# EAGLE design Adapter (EAGLE 9.6.2)
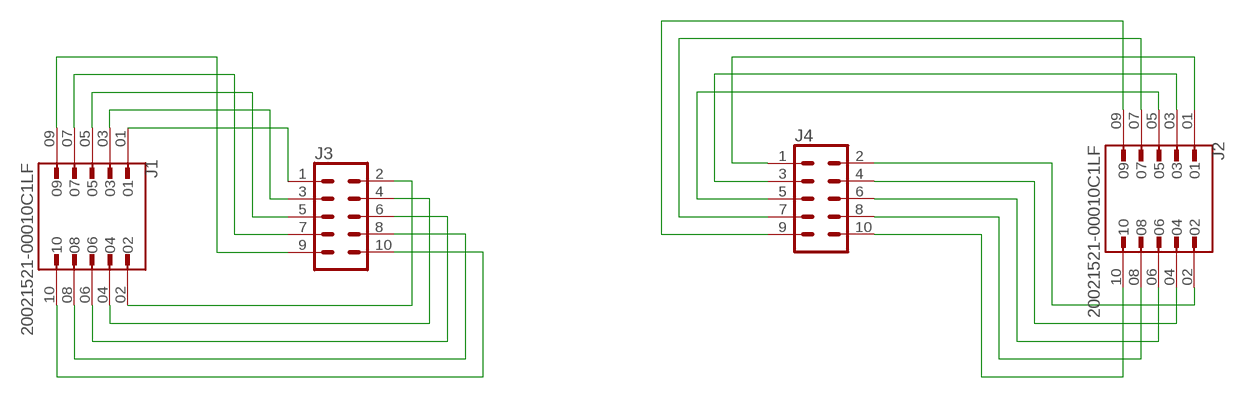
[diagram p0: schematic, sheet 1]

## Parts
J1  20021521-00010C1LF  [AMPHENOL_20021521-00010C1LF]
J2  20021521-00010C1LF  [AMPHENOL_20021521-00010C1LF]
J3  CONN_05X2NO_SILK  [2X5_NOSILK]
J4  CONN_05X2NO_SILK  [2X5_NOSILK]

## Nets
N$1: J1.01 J3.1
N$2: J1.02 J3.2
N$3: J1.03 J3.3
N$4: J1.04 J3.4
N$5: J1.05 J3.5
N$6: J1.06 J3.6
N$7: J1.07 J3.7
N$8: J1.08 J3.8
N$9: J1.09 J3.9
N$10: J1.10 J3.10
N$11: J2.01 J4.1
N$12: J2.02 J4.2
N$13: J2.03 J4.3
N$14: J2.04 J4.4
N$15: J2.05 J4.5
N$16: J2.06 J4.6
N$17: J2.07 J4.7
N$18: J2.08 J4.8
N$19: J2.09 J4.9
N$20: J2.10 J4.10

## Library data of the parts
J1 J2 = 20021521-00010C1LF:20021521-00010C1LF: Check availability <https://pricing.snapeda.com/parts/20021521-00010C1LF/AMPHENOL%20ICC%20/%20FCI/view-part?ref=eda>; AVAILABILITY: In Stock; CHECK_PRICES: https://www.snapeda.com/parts/20021521-00010C1LF/Amphenol/view-part/?ref=eda; DESCRIPTION: Minitek127®, Shrouded Board to Board Header, Surface Mount, 10 positions, 1.27mm (0.500in) pitch.; MF: AMPHENOL ICC / FCI; MP: 20021521-00010C1LF; PACKAGE: None; PRICE: None; PURCHASE-URL: https://www.snapeda.com/api/url_track_click_mouser/?unipart_id=6036216&manufacturer=AMPHENOL ICC / FCI&part_name=20021521-00010C1LF&search_term=20021521-00010c1lf; SNAPEDA_LINK: https://www.snapeda.com/parts/20021521-00010C1LF/Amphenol/view-part/?ref=snap
J3 J4 = SparkFun-Connectors:CONN_05X2: Multi connection point. Often used as Generic Header-pin footprint for 0.1 inch spaced/style header connections For AVR SPI programming port, see special device with nice symbol: "AVR_SPI_PROG_5x2.dev" You can populate with any combo of single row headers, but if you'd like an exact match, check these: 2x5 AVR ICSP Male Header <https://www.sparkfun.com/products/778> (PRT-00778) 2x5 Pin Shrouded Header <https://www.sparkfun.com/products/8506> (PRT-08506) On any of the 0.1 inch spaced packages, you can populate with these: Break Away Headers - Straight <https://www.sparkfun.com/products/116> (PRT-00116) Break Away Male Headers - Right Angle <https://www.sparkfun.com/products/553> (PRT-00553) Female Headers <https://www.sparkfun.com/products/115> (PRT-00115) Break Away Headers - Machine Pin <https://www.sparkfun.com/products/117> (PRT-00117) Break Away Female Headers - Swiss Machine Pin <https://www.sparkfun.com/products/743> (PRT-00743) Special note: the shrouded connector mates well with our 5x2 ribbon cables: 2x5 Pin IDC Ribbon Cable <https://www.sparkfun.com/products/8535> (PRT-08535)

## Net classes
0 default: width 0.305 mm

## Board
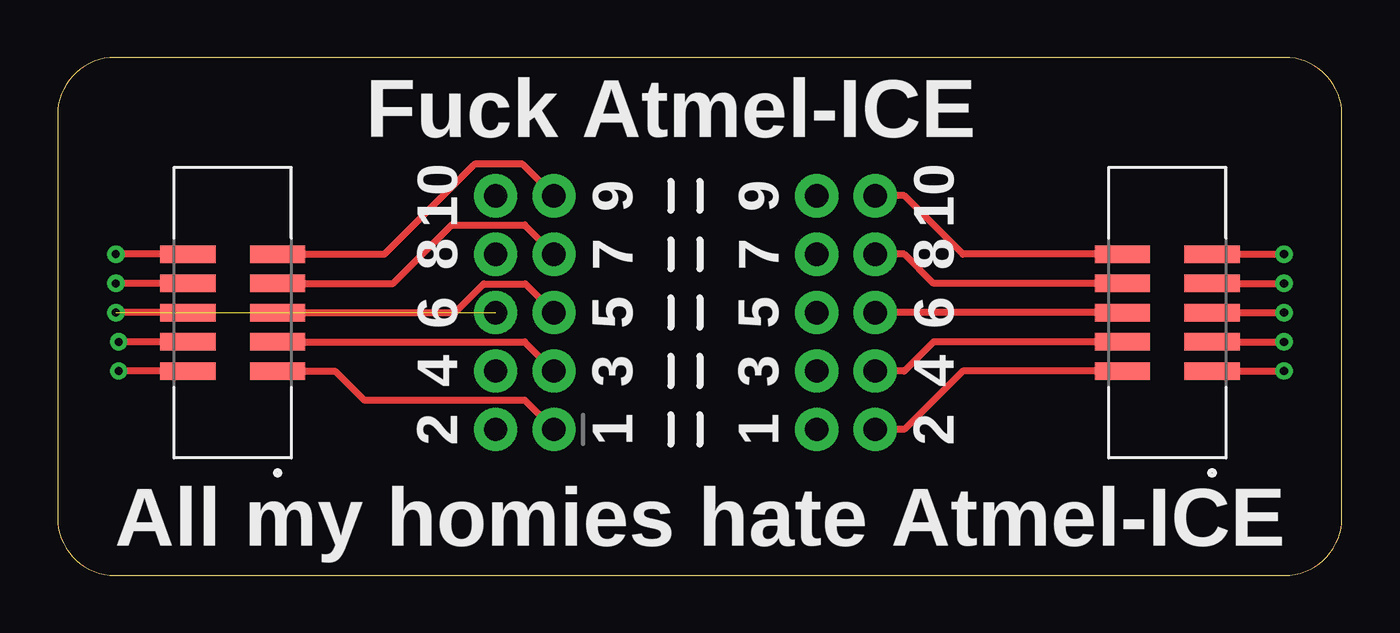
[diagram p1: board, top side]
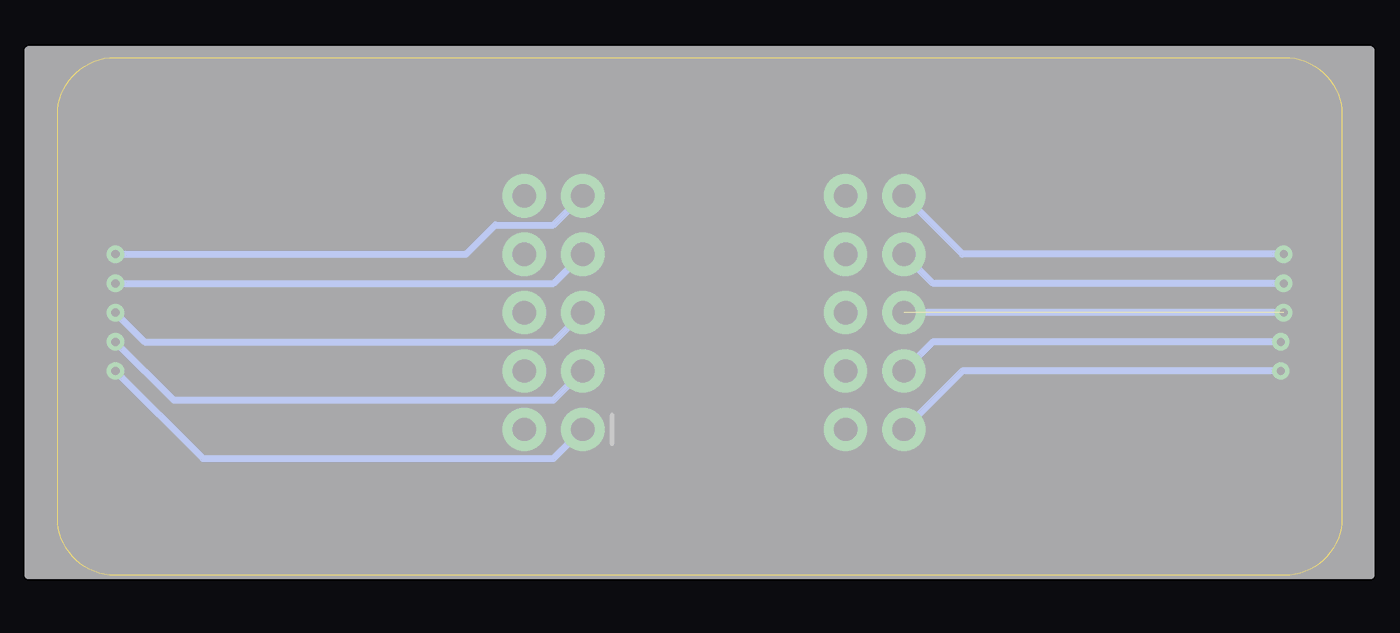
[diagram p2: board, bottom side, seen from below]

Size 55.86 x 22.53 mm. Coordinates in mm from the lower left corner, seen from the top.
Outline: 0,20.03 0,2.5 arc90 2.5,0 53.36,0 arc90 55.86,2.5 55.86,20.03 arc90 53.36,22.53 2.5,22.53 arc90 0,20.03
Copper layers (1*16): Top 0.035mm / dielectric 1.5mm / Bottom 0.035mm
Design rules "default": minimum track width 6mil, minimum drill 0.35mm, track to track 6mil, track to pad 6mil, pad to pad 6mil, via to via 6mil, smd to smd 6mil, copper to edge 40mil, drill to drill 6mil, minimum pad ring 10mil, minimum via ring 8mil, stop-mask expansion 4mil, vias tented up to drill 0mil, thermal gap 10mil

### Footprints (pad centres in the part's own frame; a part is rotated, then mirrored left to right if it is on the bottom)
AMPHENOL_20021521-00010C1LF = smd 0.76 x 2.4: 01 -2.54,-1.95; 02 -2.54,1.95; 03 -1.27,-1.95; 04 -1.27,1.95; 05 0,-1.95; 06 0,1.95; 07 1.27,-1.95; 08 1.27,1.95; 09 2.54,-1.95; 10 2.54,1.95
2X5_NOSILK = drill 1.016 pad 1.88: 1 0,0; 2 0,2.54; 3 2.54,0; 4 2.54,2.54; 5 5.08,0; 6 5.08,2.54; 7 7.62,0; 8 7.62,2.54; 9 10.16,0; 10 10.16,2.54

### Placement (x,y rotation side)
J1  7.62,11.43 90 top
J2  48.26,11.43 90 top
J3  21.59,6.35 90 top
J4  33.02,6.35 90 bottom

### Tracks (layer width: path | path; a pad name or v marks a point on that pad's centre or on a via)
N$1
  Top 0.305: J1.01 12.06,8.89 13.33,7.62 20.32,7.62 J3.1
N$2  (via drill 0.35)
  Top 0.305: J1.02 v2.66,8.89
  Bottom 0.305: v2.66,8.89 16.51,8.89 J3.2
N$3
  Top 0.305: J1.03 20.32,10.16 J3.3
N$4  (via drill 0.35)
  Top 0.305: J1.04 v2.66,10.16
  Bottom 0.305: v2.66,10.16 17.78,10.16 J3.4
N$5
  Top 0.305: J1.05 17.29,11.43 18.53,12.68 20.34,12.68 J3.5
N$6  (via drill 0.35)  (1 unrouted)
  Top 0.305: J1.06 v2.54,11.43
  Bottom 0.305: v2.54,11.43 J3.6
N$7
  Top 0.305: J1.07 14.6,12.7 17.15,15.24 20.32,15.24 J3.7
N$8  (via drill 0.35)
  Top 0.305: J1.08 v2.54,12.7
  Bottom 0.305: v2.54,12.7 17.78,12.7 J3.8
N$9
  Top 0.305: J1.09 14.22,13.97 18.16,17.91 20.19,17.91 J3.9
N$10  (via drill 0.35)
  Top 0.305: J1.10 v2.54,13.97
  Bottom 0.305: v2.54,13.97 16.51,13.97 J3.10
N$11  (via drill 0.35)
  Top 0.305: J2.01 v53.34,8.89
  Bottom 0.305: v53.34,8.89 49.53,5.08 34.29,5.08 J4.1
N$12
  Top 0.305: J2.02 39.37,8.89 36.83,6.35 J4.2
N$13  (via drill 0.35)
  Top 0.305: J2.03 v53.34,10.16
  Bottom 0.305: v53.34,10.16 50.8,7.62 34.29,7.62 J4.3
N$14
  Top 0.305: J2.04 38.1,10.16 36.83,8.89 J4.4
N$15  (via drill 0.35)
  Top 0.305: J2.05 v53.34,11.43
  Bottom 0.305: v53.34,11.43 52.07,10.16 34.29,10.16 J4.5
N$16
  Top 0.305: J2.06 J4.6
N$17  (via drill 0.35)
  Top 0.305: J2.07 v53.34,12.7
  Bottom 0.305: v53.34,12.7 34.29,12.7 J4.7
N$18
  Top 0.305: J2.08 38.1,12.7 36.83,13.97 J4.8
N$19  (via drill 0.35)
  Top 0.305: J2.09 v53.34,13.97
  Bottom 0.305: v53.34,13.97 38.1,13.97 36.83,15.24 34.29,15.24 J4.9
N$20
  Top 0.305: J2.10 39.37,13.97 36.83,16.51 J4.10

### Text on the board
tPlace: Fuck Atmel-ICE | 10 | 9 | 9 | 10 | 8 | 7 | 7 | 8 | 6 | 5 | 5 | 5 | 6 | 4 | 3 | 3 | 4 | 2 | 1 | 1 | 2 | All my homies hate Atmel-ICE